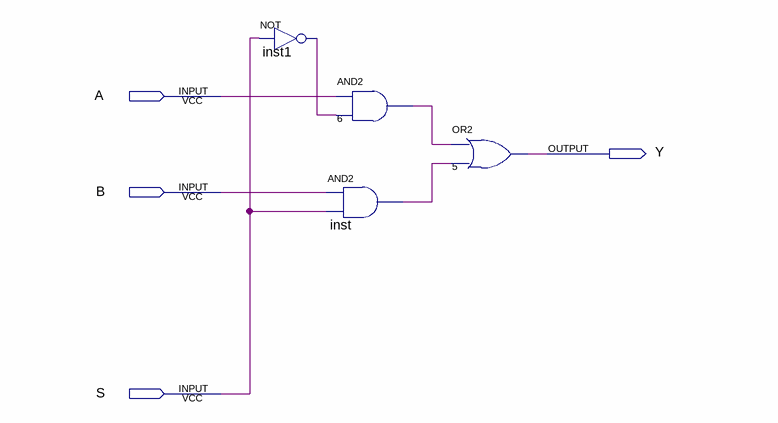
[diagram p0: schematic sheet]
// Quartus schematic mux2-1bit.bdf as structural Verilog: 4 symbols, 4 pins
module \mux2-1bit  (
  input  A,
  input  B,
  input  S,
  output Y
);

  wire inst1_out, inst_out, n6_out;

  not inst1 (inst1_out, S);
  and u_6 (n6_out, A, inst1_out);
  and inst (inst_out, B, S);
  or u_5 (Y, n6_out, inst_out);
endmodule
